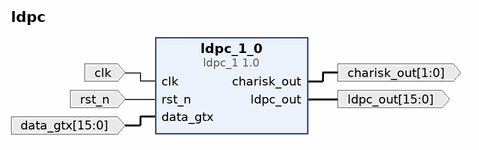
[diagram p0: block diagram of the top level]
# Vivado block design ldpc, xc7k325tffg900-2, Vivado 2017.4
create_bd_design ldpc

create_bd_port -dir I -type clk clk
create_bd_port -dir I -type rst rst_n
create_bd_port -dir I -from 15 -to 0 data_gtx
create_bd_port -dir O -from 15 -to 0 ldpc_out
create_bd_port -dir O -from 1 -to 0 charisk_out

create_bd_cell -type ip -vlnv gpnewtech.com:userdefine:ldpc_1:1.0 ldpc_1_0

# ---- connections ----

connect_bd_net -net clk_0_1 [get_bd_ports clk] [get_bd_pins ldpc_1_0/clk]
connect_bd_net -net rst_n_0_1 [get_bd_ports rst_n] [get_bd_pins ldpc_1_0/rst_n]
connect_bd_net -net data_gtx_0_1 [get_bd_ports data_gtx] [get_bd_pins ldpc_1_0/data_gtx]
connect_bd_net [get_bd_pins ldpc_1_0/ldpc_out] [get_bd_ports ldpc_out]
connect_bd_net [get_bd_pins ldpc_1_0/charisk_out] [get_bd_ports charisk_out]

validate_bd_design
save_bd_design
